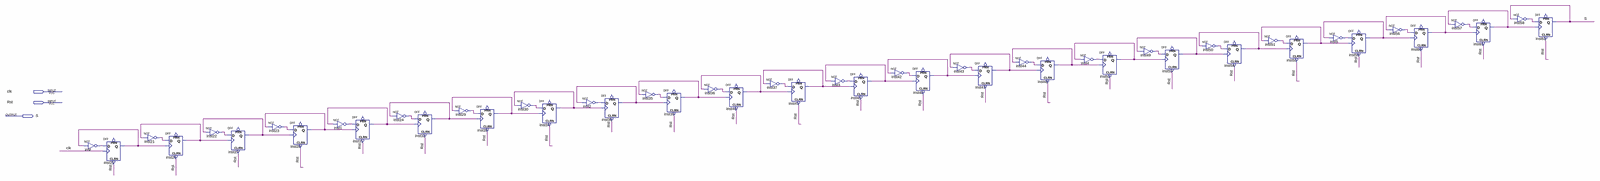
[diagram p0: schematic sheet, whole]
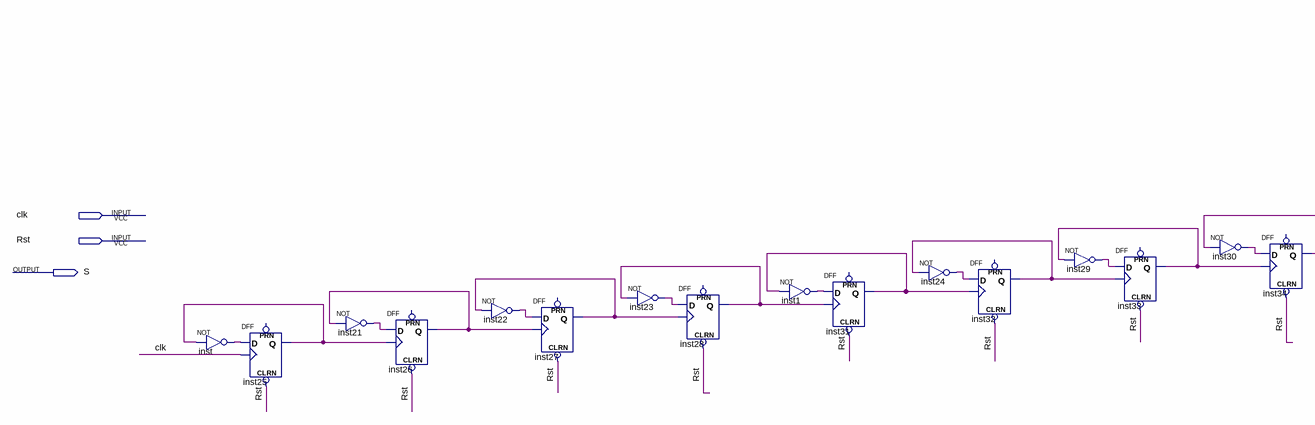
[diagram p1: schematic sheet, left part]
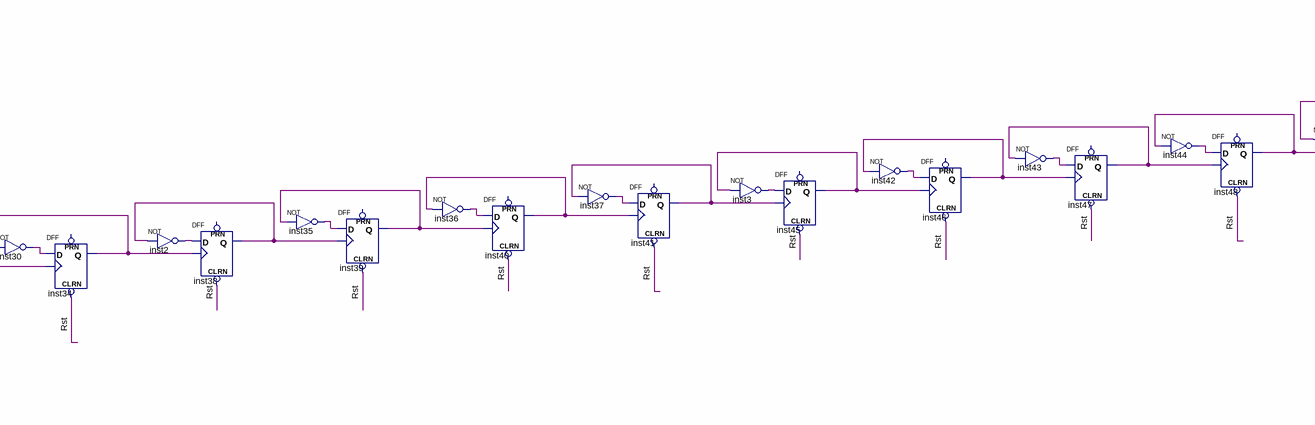
[diagram p2: schematic sheet, centre part]
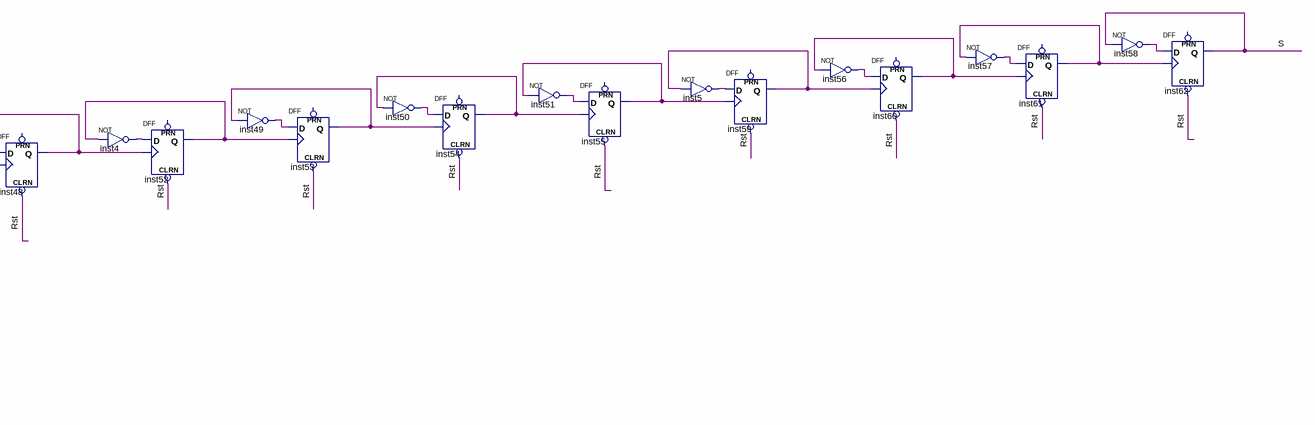
[diagram p3: schematic sheet, right part]
// Quartus schematic divisorFreq.bdf as structural Verilog: 48 symbols, 3 pins
module divisorFreq (
  input  clk,
  input  Rst,
  output S
);

  wire inst1_out, inst2_out, inst3_out, inst4_out, inst5_out, inst21_out, inst22_out, inst23_out, inst24_out,
       inst25_q, inst26_q, inst27_q, inst28_q, inst29_out, inst30_out, inst31_q, inst32_q, inst33_q,
       inst34_q, inst35_out, inst36_out, inst37_out, inst38_q, inst39_q, inst40_q, inst41_q, inst42_out,
       inst43_out, inst44_out, inst45_q, inst46_q, inst47_q, inst48_q, inst49_out, inst50_out, inst51_out,
       inst52_q, inst53_q, inst54_q, inst55_q, inst56_out, inst57_out, inst58_out, inst59_q, inst60_q,
       inst61_q, inst_out;

  not inst (inst_out, inst25_q);
  DFF inst25 (.CLRN(Rst), .CLK(clk), .D(inst_out), .Q(inst25_q));  // open: PRN
  not inst21 (inst21_out, inst26_q);
  DFF inst26 (.CLRN(Rst), .CLK(inst25_q), .D(inst21_out), .Q(inst26_q));  // open: PRN
  not inst22 (inst22_out, inst27_q);
  DFF inst27 (.CLRN(Rst), .CLK(inst26_q), .D(inst22_out), .Q(inst27_q));  // open: PRN
  not inst23 (inst23_out, inst28_q);
  DFF inst28 (.CLRN(Rst), .CLK(inst27_q), .D(inst23_out), .Q(inst28_q));  // open: PRN
  not inst1 (inst1_out, inst31_q);
  DFF inst31 (.CLRN(Rst), .CLK(inst28_q), .D(inst1_out), .Q(inst31_q));  // open: PRN
  not inst24 (inst24_out, inst32_q);
  DFF inst32 (.CLRN(Rst), .CLK(inst31_q), .D(inst24_out), .Q(inst32_q));  // open: PRN
  not inst29 (inst29_out, inst33_q);
  DFF inst33 (.CLRN(Rst), .CLK(inst32_q), .D(inst29_out), .Q(inst33_q));  // open: PRN
  not inst30 (inst30_out, inst34_q);
  DFF inst34 (.CLRN(Rst), .CLK(inst33_q), .D(inst30_out), .Q(inst34_q));  // open: PRN
  not inst2 (inst2_out, inst38_q);
  DFF inst38 (.CLRN(Rst), .CLK(inst34_q), .D(inst2_out), .Q(inst38_q));  // open: PRN
  not inst35 (inst35_out, inst39_q);
  DFF inst39 (.CLRN(Rst), .CLK(inst38_q), .D(inst35_out), .Q(inst39_q));  // open: PRN
  not inst36 (inst36_out, inst40_q);
  DFF inst40 (.CLRN(Rst), .CLK(inst39_q), .D(inst36_out), .Q(inst40_q));  // open: PRN
  not inst37 (inst37_out, inst41_q);
  DFF inst41 (.CLRN(Rst), .CLK(inst40_q), .D(inst37_out), .Q(inst41_q));  // open: PRN
  not inst3 (inst3_out, inst45_q);
  DFF inst45 (.CLRN(Rst), .CLK(inst41_q), .D(inst3_out), .Q(inst45_q));  // open: PRN
  not inst42 (inst42_out, inst46_q);
  DFF inst46 (.CLRN(Rst), .CLK(inst45_q), .D(inst42_out), .Q(inst46_q));  // open: PRN
  not inst43 (inst43_out, inst47_q);
  DFF inst47 (.CLRN(Rst), .CLK(inst46_q), .D(inst43_out), .Q(inst47_q));  // open: PRN
  not inst44 (inst44_out, inst48_q);
  DFF inst48 (.CLRN(Rst), .CLK(inst47_q), .D(inst44_out), .Q(inst48_q));  // open: PRN
  not inst4 (inst4_out, inst52_q);
  DFF inst52 (.CLRN(Rst), .CLK(inst48_q), .D(inst4_out), .Q(inst52_q));  // open: PRN
  not inst49 (inst49_out, inst53_q);
  DFF inst53 (.CLRN(Rst), .CLK(inst52_q), .D(inst49_out), .Q(inst53_q));  // open: PRN
  not inst50 (inst50_out, inst54_q);
  DFF inst54 (.CLRN(Rst), .CLK(inst53_q), .D(inst50_out), .Q(inst54_q));  // open: PRN
  not inst51 (inst51_out, inst55_q);
  DFF inst55 (.CLRN(Rst), .CLK(inst54_q), .D(inst51_out), .Q(inst55_q));  // open: PRN
  not inst5 (inst5_out, inst59_q);
  DFF inst59 (.CLRN(Rst), .CLK(inst55_q), .D(inst5_out), .Q(inst59_q));  // open: PRN
  not inst56 (inst56_out, inst60_q);
  DFF inst60 (.CLRN(Rst), .CLK(inst59_q), .D(inst56_out), .Q(inst60_q));  // open: PRN
  not inst57 (inst57_out, inst61_q);
  DFF inst61 (.CLRN(Rst), .CLK(inst60_q), .D(inst57_out), .Q(inst61_q));  // open: PRN
  not inst58 (inst58_out, S);
  DFF inst62 (.CLRN(Rst), .CLK(inst61_q), .D(inst58_out), .Q(S));  // open: PRN
endmodule
